# EAGLE design bt_rc_car_remote (EAGLE 9.5.1)
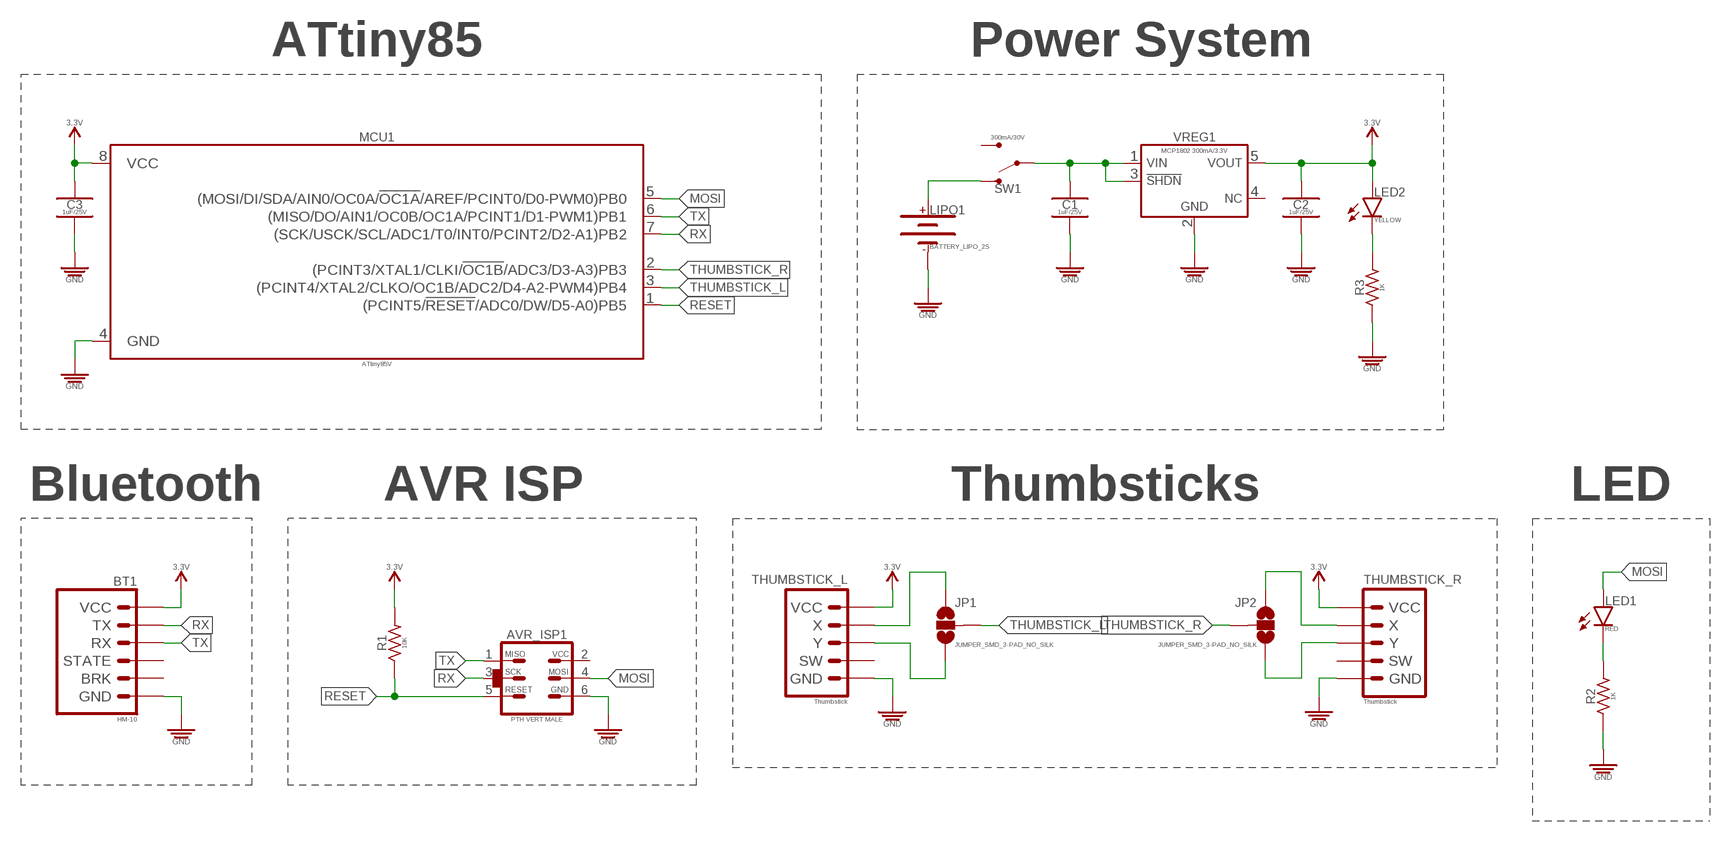
[diagram p0: schematic, sheet 1]

## Parts
AVR_ISP1  PTH VERT MALE  AVR_SPI_PRG_6_PTH_VERT_MALE_2.54MM  [HDRV6W64P254_2X3_762X483X838B_AVR-ISP]
BT1  HM-10  BLUETOOTH_HM-10_PTH_RA_FEMALE_2.54MM  [HDRRAR6W60P254_1X6_1574X850X274B]
C1  1uF/25V  1UF_CER_SMD-0805_25V-10%  [CAPC2012X95_SMD-0805]
C2  1uF/25V  1UF_CER_SMD-0805_25V-10%  [CAPC2012X95_SMD-0805]
C3  1uF/25V  1UF_CER_SMD-0805_25V-10%  [CAPC2012X95_SMD-0805]
JP1  JUMPER_SMD_3-PAD_NO_SILK  [SMT-JUMPER_3_NO_SILK]
JP2  JUMPER_SMD_3-PAD_NO_SILK  [SMT-JUMPER_3_NO_SILK]
LED1  RED  LED_SMD-0805_DISCRETE_RED  [LEDC2012X120_LED-0805]
LED2  YELLOW  LED_SMD-0805_DISCRETE_YELLOW  [LEDC2012X120_LED-0805]
LIPO1  BATTERY_LIPO_2S  [DUAL_PTH_PADS]
MCU1  ATtiny85V  ATTINY-X5_SO-8_ATTINY-85V  [SOIC127P798X216-8]
R1  10K  10KΩ_SMD-0805_1/8W-5%  [RESC2012X60_SMD-0805]
R2  1K  1KΩ_SMD-0805_1/8W-5%  [RESC2012X60_SMD-0805]
R3  1K  1KΩ_SMD-0805_1/8W-5%  [RESC2012X60_SMD-0805]
SW1  300mA/30V  SWITCH_SPDT_PTH_VERT_300MA-30V_8.6L-4.3W  [SW_SLIDE_SPDT_VERT_8.6L-4.3W]
THUMBSTICK_L  Thumbstick  THUMBSTICK-2AXIS_BREAKOUT_PTH_RA_FEMALE_2.54MM  [HDRRAR5W60P254_1X5_1320X850X274B]
THUMBSTICK_R  Thumbstick  THUMBSTICK-2AXIS_BREAKOUT_PTH_RA_FEMALE_2.54MM  [HDRRAR5W60P254_1X5_1320X850X274B]
VREG1  MCP1802 300mA/3.3V  MCP18XX_MCP1802-330_300MA-3.3V  [SOT95P280X145-5]

## Nets
3.3V: BT1.VCC C2.1 C3.1 LED2.A MCU1.8(VCC) R1.2 THUMBSTICK_L.VCC THUMBSTICK_R.VCC VREG1.5(VOUT)
GND: AVR_ISP1.GND BT1.GND C1.2 C2.2 C3.2 LIPO1.- MCU1.4(GND) R2.1 R3.1 THUMBSTICK_L.GND THUMBSTICK_R.GND VREG1.2(GND)
MOSI: AVR_ISP1.MOSI LED1.A MCU1.5((MOSI/DI/SDA/AIN0/OC0A/!OC1A!/AREF/PCINT0/D0-PWM0)PB0)
N$1: JP1.1 THUMBSTICK_L.X
N$2: JP1.3 THUMBSTICK_L.Y
N$3: JP2.1 THUMBSTICK_R.X
N$4: JP2.3 THUMBSTICK_R.Y
N$5: LED1.K R2.2
N$6: LIPO1.+ SW1.S1
N$7: C1.1 SW1.P VREG1.1(VIN) VREG1.3(!SHDN)
N$10: LED2.K R3.2
RESET: AVR_ISP1.RESET MCU1.1((PCINT5/!RESET!/ADC0/DW/D5-A0)PB5) R1.1
RX: AVR_ISP1.SCK BT1.TX MCU1.7((SCK/USCK/SCL/ADC1/T0/INT0/PCINT2/D2-A1)PB2)
THUMBSTICK_L: JP1.2 MCU1.3((PCINT4/XTAL2/CLKO/OC1B/ADC2/D4-A2-PWM4)PB4)
THUMBSTICK_R: JP2.2 MCU1.2((PCINT3/XTAL1/CLKI/!OC1B!/ADC3/D3-A3)PB3)
TX: AVR_ISP1.MISO BT1.RX MCU1.6((MISO/DO/AIN1/OC0B/OC1A/PCINT1/D1-PWM1)PB1)
Unconnected: AVR_ISP1.VCC BT1.BRK BT1.STATE SW1.S2 THUMBSTICK_L.SW THUMBSTICK_R.SW VREG1.4(NC)

## Notes on the sheet
- ATtiny85 | Power System
- Bluetooth | AVR ISP | Thumbsticks | LED

## Library data of the parts
AVR_ISP1 = PiB_connectors:AVR_SPI_PRG_6: AVR ISP 6 Pin This is the reduced ISP connector for AVR programming. Common on Arduino. This footprint will take up less PCB space and can be used with a 10-pin to 6-pin adapter such as SKU: BOB-08508; DATASHEET: https://cdn.amphenol-icc.com/media/wysiwyg/files/drawing/67996.pdf; DIST: Digikey; DISTLINK: https://www.digikey.com/products/en?keywords=609-3234-ND; DISTPN: 609-3234-ND; MFR: Amphenol FCI; MPN: 67997-206HLF
BT1 = PiB_radio_frequency:BLUETOOTH_HM-10; DATASHEET: http://fab.cba.mit.edu/classes/863.15/doc/tutorials/programming/bluetooth/bluetooth40_en.pdf; DATASHEET_CONNECTOR: http://www.sullinscorp.com/drawings/78_P(N)PxCxx1LGBN-RC,_10493-G.pdf; DIST: Amazon; DISTLINK: https://www.amazon.com/SunFounder-Bluetooth-Master-Module-Arduino/dp/B00V07U93U; DISTLINK_CONNECTOR: https://www.digikey.com/products/en?keywords=PPTC061LGBN-RC; DISTPN: B00V07U93U; DISTPN_CONNECTOR: S5442-ND; DIST_CONNECTOR: Digikey; MFR: JNHuaMao Technology Company; MFR_CONNECTOR: Sullins Connector Solutions; MPN: HM-10; MPN_CONNECTOR: PPTC061LGBN-RC
C1-C3 = PiB_capacitors:1UF; DATASHEET: https://api.kemet.com/component-edge/download/datasheet/C0805C105K3RACTU.pdf; DIST: Digikey; DISTLINK: https://www.digikey.com/products/en?keywords=399-8004-1-ND; DISTPN: 399-8004-1-ND; MFR: KEMET; MPN: C0805C105K3RACTU
JP1 JP2 = PiB_connectors:JUMPER_SMD_3-PAD_NO: Normally open jumper This jumper has three pads in close proximity to each other. Apply solder to close the connection(s).
LED1 = PiB_leds:LED; DATASHEET: http://optoelectronics.liteon.com/upload/download/DS-22-99-0150/LTST-C170KRKT.pdf; DIST: Digikey; DISTLINK: https://www.digikey.com/products/en?keywords=160-1415-1-ND; DISTPN: 160-1415-1-ND; MFR: Lite-On Inc.; MPN: LTST-C170KRKT
LED2 = PiB_leds:LED; DATASHEET: http://optoelectronics.liteon.com/upload/download/DS-22-99-0188/LTST-C170KSKT.pdf; DIST: Digikey; DISTLINK: https://www.digikey.com/products/en?keywords=160-1416-1-ND; DISTPN: 160-1416-1-ND; MFR: Lite-On Inc.; MPN: LTST-C170KSKT
LIPO1 = PiB_batteries:BATTERY_LIPO_2S
MCU1 = PiB_ic_microcontrollers:ATTINY-X5; DATASHEET: http://ww1.microchip.com/downloads/en/DeviceDoc/Atmel-2586-AVR-8-bit-Microcontroller-ATtiny25-ATtiny45-ATtiny85_Datasheet-Summary.pdf; DIST: Digikey; DISTLINK: https://www.digikey.com/products/en?keywords=ATTINY85V-10SU-ND; DISTPN: ATTINY85V-10SU-ND; MFR: Microchip Technology; MPN: ATTINY85V-10SU
R1 = PiB_resistors:10KΩ; DATASHEET: http://www.yageo.com/documents/recent/PYu-RC_Group_51_RoHS_L_9.pdf; DIST: Digikey; DISTLINK: https://www.digikey.com/products/en?keywords=311-10KARCT-ND; DISTPN: 311-10KARCT-ND; MFR: Yageo; MPN: RC0805JR-0710KL
R2 R3 = PiB_resistors:1KΩ; DATASHEET: http://www.yageo.com/documents/recent/PYu-RC_Group_51_RoHS_L_9.pdf; DIST: Digikey; DISTLINK: https://www.digikey.com/products/en?keywords=311-1.0KARCT-ND; DISTPN: 311-1.0KARCT-ND; MFR: Yageo; MPN: RC0805JR-071KL
SW1 = PiB_switches:SWITCH_SPDT; DATASHEET: https://media.digikey.com/pdf/Data%20Sheets/C&K/SS-12D07-VG_GA_PA.pdf; DIST: Digikey; DISTLINK: https://www.digikey.com/products/en?keywords=CKN10397-ND; DISTPN: CKN10397-ND; MFR: C&K; MPN: SS-12D07-VG 4 NS GA PA
THUMBSTICK_L THUMBSTICK_R = PiB:THUMBSTICK-2AXIS_BREAKOUT; DATASHEET_CONNECTOR: http://www.sullinscorp.com/drawings/78_P(N)PxCxx1LGBN-RC,_10493-G.pdf; DIST: Amazon; DISTLINK: https://www.amazon.com/WGCD-Joystick-Breakout-Controller-Arduino/dp/B01N59MK0U/ref=pd_lpo_vtph_107_bs_t_2?_encoding=UTF8&psc=1&refRID=MHMRTBXG0N745Z8HJ9AT; DISTLINK_CONNECTOR: https://www.digikey.com/products/en?keywords=PPTC051LGBN-RC; DISTPN: B01N59MK0U; DIST_CONNECTOR: Digikey; MFR: WGCD; MFR_CONNECTOR: Sullins Connector Solutions; MPN: N/A; MPN_CONNECTOR: PPTC051LGBN-RC
VREG1 = PiB_ic_power:MCP18XX; DATASHEET: http://ww1.microchip.com/downloads/en/DeviceDoc/22053C.pdf; DIST: Digikey; DISTLINK: https://www.digikey.com/products/en?keywords=MCP1802T-3302I%2FOTCT-ND; DISTPN: MCP1802T-3302I/OTCT-ND; MFR: Microchip Technology; MPN: MCP1802T-3302I/OT

## Board
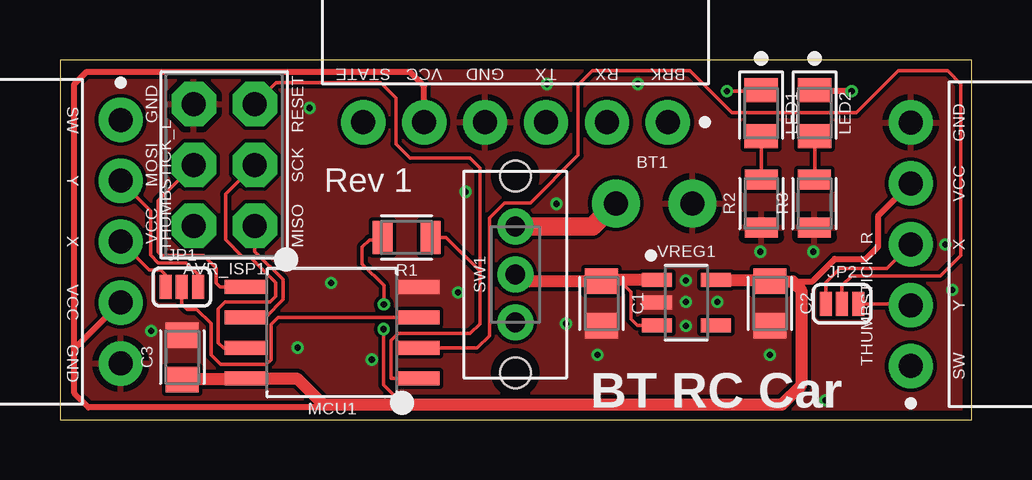
[diagram p1: board, top side]
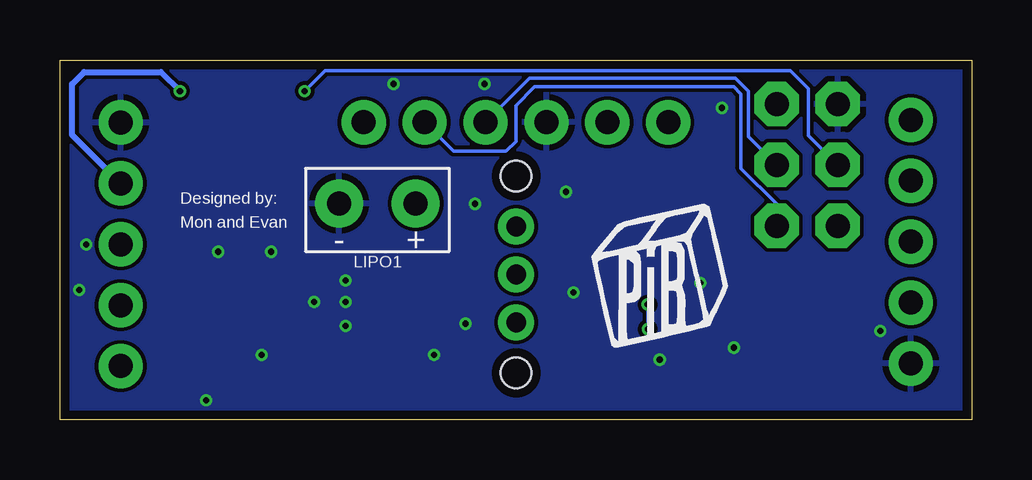
[diagram p2: board, bottom side, seen from below]

Size 38 x 15 mm. Coordinates in mm from the lower left corner, seen from the top.
Outline: 0,0 38,0 38,15 0,15 0,0
Copper layers (1*16): Top 0.035559375mm / dielectric 1.6mm / Bottom 0.035559375mm
Design rules "oshpark-2layer": minimum track width 6mil, minimum drill 10mil, track to track 6mil, track to pad 6mil, pad to pad 6mil, via to via 6mil, smd to smd 6mil, copper to edge 15mil, drill to drill 6mil, minimum pad ring 5mil, minimum via ring 5mil, stop-mask expansion 2.5mil, vias tented up to drill 0mil, thermal gap 10mil

### Footprints (pad centres in the part's own frame; a part is rotated, then mirrored left to right if it is on the bottom)
HDRV6W64P254_2X3_762X483X838B_AVR-ISP = drill 1 pad 1.85 octagon: GND 5.08,2.54; MISO 0,0; MOSI 2.54,2.54; RESET 5.08,0; SCK 2.54,0; VCC 0,2.54
HDRRAR6W60P254_1X6_1574X850X274B = drill 1 pad 1.85: BRK 0,0; GND 7.62,0; RX 2.54,0; STATE 12.7,0; TX 5.08,0; VCC 10.16,0
CAPC2012X95_SMD-0805 = smd 1.065 x 1.379: 1 -0.925,0; 2 0.925,0
SMT-JUMPER_3_NO_SILK = smd 0.5 x 1: 1 -0.678,0; 2 0,0; 3 0.678,0
LEDC2012X120_LED-0805 = smd 1.01 x 1.379: A -0.96,0; K 0.96,0
DUAL_PTH_PADS = drill 1 pad 2: + -1.6,0; - 1.6,0
SOIC127P798X216-8 = smd 1.714 x 0.582: 1 -3.628,1.905; 2 -3.628,0.635; 3 -3.628,-0.635; 4 -3.628,-1.905; 5 3.628,-1.905; 6 3.628,-0.635; 7 3.628,0.635; 8 3.628,1.905
RESC2012X60_SMD-0805 = smd 0.838 x 1.379: 1 -0.995,0; 2 0.995,0
SW_SLIDE_SPDT_VERT_8.6L-4.3W = drill 0.825 pad 1.5: P 0,0; S1 0,2; S2 0,-2 | hole 1.275: 0,4.1; 0,-4.1
HDRRAR5W60P254_1X5_1320X850X274B = drill 1 pad 1.85: GND 10.16,0; SW 0,0; VCC 7.62,0; X 5.08,0; Y 2.54,0
SOT95P280X145-5 = smd 1.253 x 0.589: 1 -1.231,0.95; 2 -1.231,0; 3 -1.231,-0.95; 4 1.231,-0.95; 5 1.231,0.95

### Placement (x,y rotation side)
AVR_ISP1  8.12,8.08 90 top
BT1  25.34,12.4 180 top
C1  22.58,4.84 270 top
C2  29.6,4.84 270 top
C3  5.1,2.6 90 top
JP1  5.08,5.53 0 top
JP2  32.6,4.83 0 top
LED1  29.23,12.78 270 top
LED2  31.46,12.78 270 top
LIPO1  24.77,9.02 180 bottom
MCU1  11.34,3.62 180 top
R1  14.45,7.6 180 top
R2  29.24,9.01 90 top
R3  31.45,9.01 90 top
SW1  18.98,6.05 0 top
THUMBSTICK_L  2.53,12.5 270 top
THUMBSTICK_R  35.47,2.23 90 top
U$1  [PIB_LOGO_10MM]  13,6 0 bottom
VREG1  26.11,4.88 0 top

### Tracks (layer width: path | path; a pad name or v marks a point on that pad's centre or on a via)
3.3V  (via drill 0.25)
  Top 0.152: R1.2 13.36,7.5 12.9,7.5 12.6,7.2 12.6,6.5 13.5,5.6 v13.5,4.8 | v13.49,3.77 v13.5,3.77 13.5,1.44 14.3,0.64
  Top 0.254: 30.54,5.76 31.37,5.76 32.3,6.7 33.6,6.7 34.1,7.2 34.1,8.48 THUMBSTICK_R.VCC | v33,13.7 31.5,13.7 LED2.A | 10.96,0.64 10.84,0.51 1.19,0.51 0.6,1.1 0.6,2.95 | 0.6,2.95 0.6,13.99 1.1,14.49 14.6,14.49 15.18,13.91 BT1.VCC | THUMBSTICK_L.VCC 0.6,2.95
  Top 0.508: VREG1.5 29.54,5.83 C2.1 30.54,5.76 30.9,5.4 30.9,1.44 30.1,0.64 14.3,0.64 10.96,0.64 9.88,1.72 MCU1.8 7.67,1.68 C3.1
  Bottom 0.152: v13.5,4.8 v13.49,4.79 v13.49,3.77
  Bottom 0.254: THUMBSTICK_R.VCC 37.49,11.87 37.49,14 37,14.49 33.79,14.49 v33,13.7
GND  (via drill 0.25)
  other vias: 3.8,3.7 9.9,3 13,2.5 10.4,13 16.9,9.5 16.6,5.3 11.3,5.7 31.9,0.8 37.2,5.4 26.1,4.9 29.6,2.7 22.4,2.7 26.1,5.8 26.1,3.9 27.4,4.9 21.1,4 29.2,7 31.4,7 20.7,9 20.3,14 24.1,14 36.9,7.3
  pour Top: 0,15.5 0,-0.5 38,-0.5 38,15.5
  pour Bottom: 0,15.5 0,-0.5 38,-0.5 38,15.5
MOSI  (via drill 0.25)
  Top 0.152: AVR_ISP1.MOSI 4.09,9.13 4.09,7 4.24,6.85 5.98,6.85 6.5,6.33 6.5,5.7 6.68,5.53 MCU1.5 | v27.8,13.7 29.19,13.7 LED1.A
  Bottom 0.152: AVR_ISP1.MOSI 6.8,11.84 6.8,13.8 7.54,14.54 26.96,14.54 v27.8,13.7
N$1
  Top 0.152: JP1.1 4.4,6.04 4.2,6.24 3.71,6.24 THUMBSTICK_L.X
N$2
  Top 0.152: JP1.3 5.76,6.04 5.26,6.54 4.1,6.54 3.78,6.86 3.78,8.7 THUMBSTICK_L.Y
N$3
  Top 0.152: THUMBSTICK_R.X 34.47,6.3 32.51,6.3 31.92,5.72 JP2.1
N$4
  Top 0.152: JP2.3 35.41,4.83 THUMBSTICK_R.Y
N$5
  Top 0.152: LED1.K R2.2
N$6
  Top 0.762: SW1.S1 22.2,8.05 LIPO1.+
N$7
  Top 0.152: VREG1.3 24.07,3.93 24,4 23.8,4.2 23.8,5.33 23.3,5.83
  Top 0.508: SW1.P 19.27,5.76 C1.1 22.64,5.83 23.3,5.83 VREG1.1
N$10
  Top 0.152: LED2.K R3.2
RESET
  Top 0.152: MCU1.1 13.8,1.72 13.8,3.3 14.1,3.6 17.1,3.6 17.5,4 17.5,6.2 | R1.1 16.1,7.6 17.5,6.2 | 17.5,6.2 17.5,10.5 17.1,10.9 14.6,10.9 14,11.5 14,13.4 13.36,14.04 9,14.04 AVR_ISP1.RESET
RX
  Top 0.152: AVR_ISP1.SCK 6.9,9.4 6.9,7.51 7.6,6.81 7.9,6.81 9,5.71 9,5.14 8.76,4.9 6.88,4.9 6.6,4.62 6.6,3.2 6.81,2.98 MCU1.7
  Bottom 0.152: AVR_ISP1.SCK 9.3,11.8 9.3,13.7 9.84,14.24 18.42,14.24 BT1.TX
THUMBSTICK_L
  Top 0.152: JP1.2 5.08,4.82 5.3,4.6 5.7,4.6 6.29,4 6.29,3.07 6.3,3.07 6.3,2.7 6.7,2.3 8.6,2.3 8.8,2.5 8.8,3.97 9.09,4.25 MCU1.3
THUMBSTICK_R
  Top 0.152: MCU1.2 17.39,2.98 17.9,3.5 17.9,8.4 18.53,9.03 19.61,9.03 21.6,11.02 21.6,13.94 22.2,14.54 26.26,14.54 28,12.8 33.2,12.8 34.94,14.54 37,14.54 37.54,14 37.54,6.84 36.7,6 33,6 32.6,5.6 JP2.2
TX
  Top 0.152: AVR_ISP1.MISO 8.12,7.02 9.3,5.84 9.3,5 8.57,4.27 7.72,4.27 MCU1.6
  Bottom 0.152: AVR_ISP1.MISO 8.12,8.99 9.61,10.47 9.61,13.57 9.92,13.88 18.22,13.88 19,13.1 19,11.6 19.4,11.2 21.6,11.2 BT1.RX

### Text on the board
tPlace: Rev 1 | BT RC Car
bPlace: Designed by: | Mon and Evan